# EAGLE design Rx (EAGLE 9.7.0)
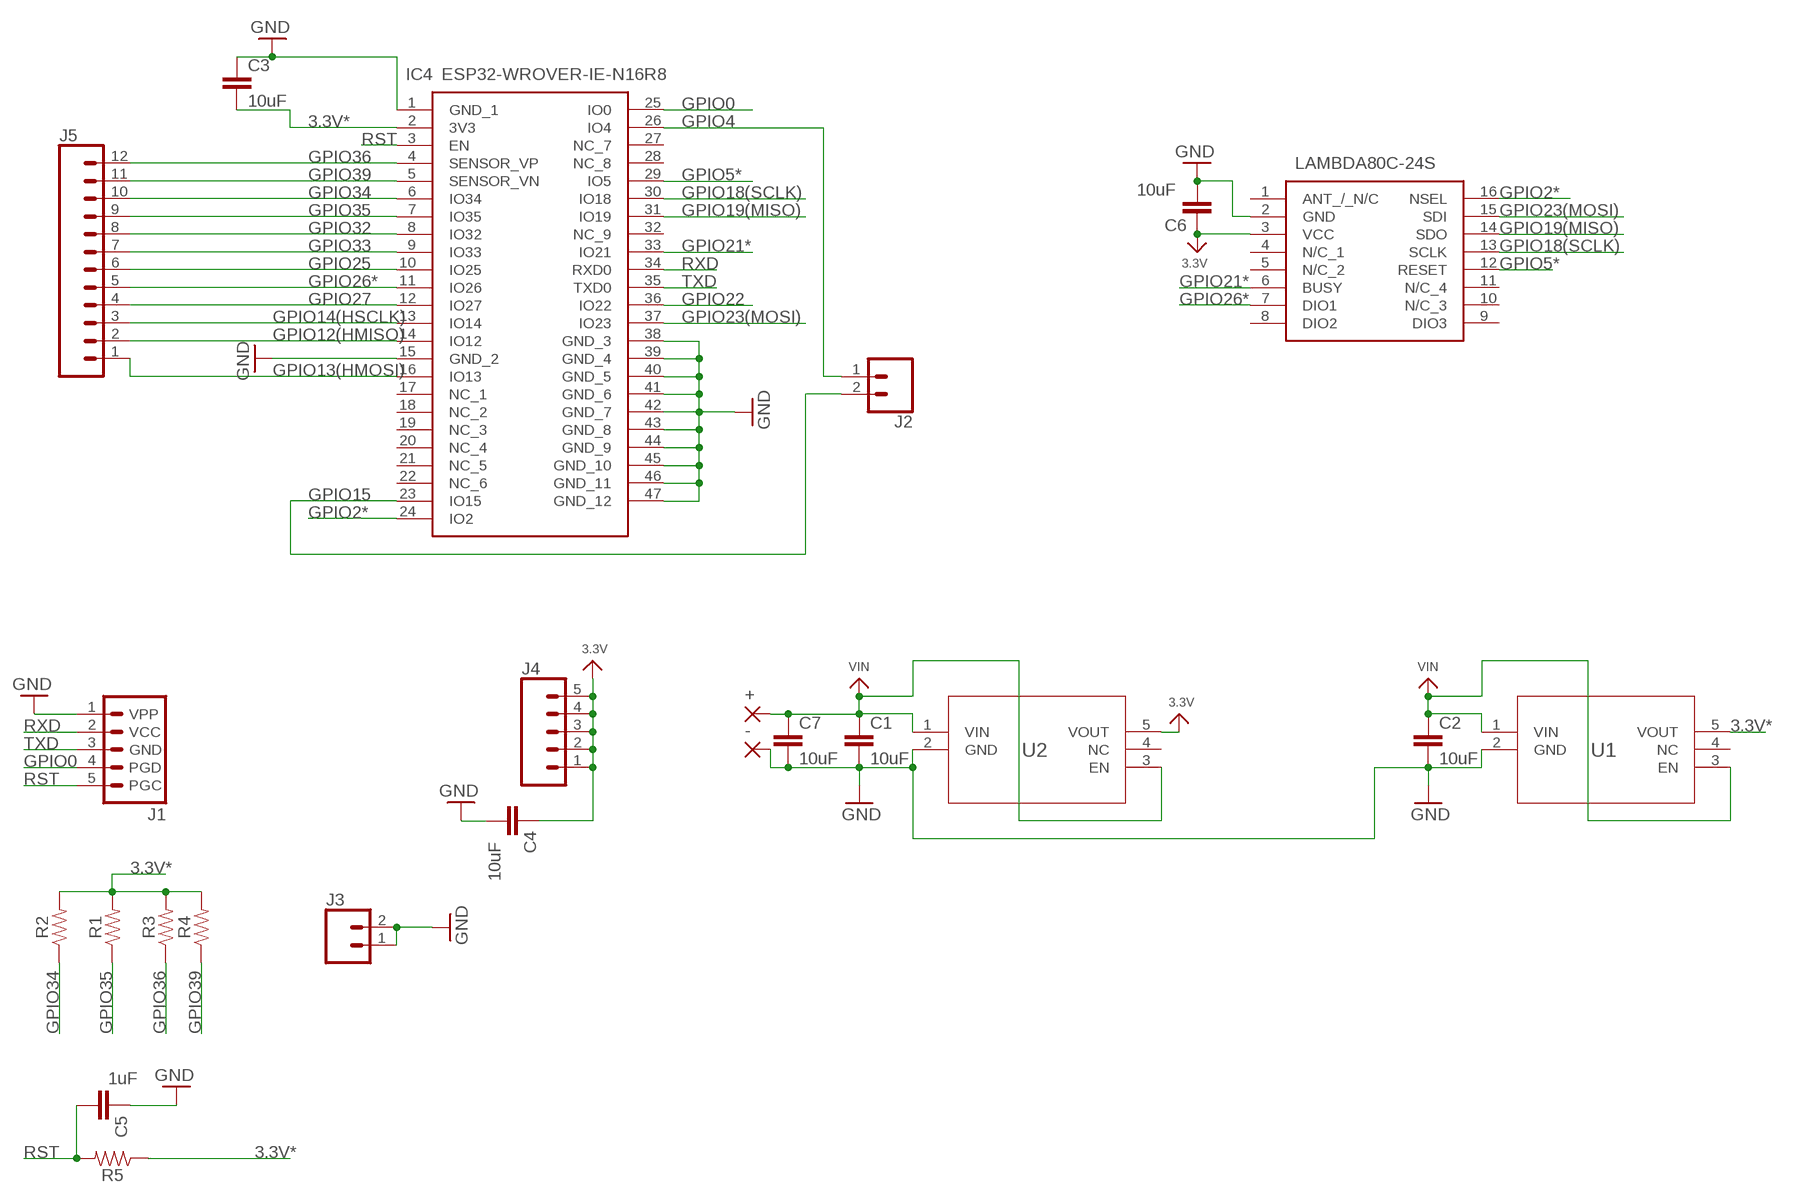
[diagram p0: schematic, sheet 1]

## Parts
+  2,15/1,0  [2,15/1,0]
-  2,15/1,0  [2,15/1,0]
C1  10uF  10UF-0805-10V-10%  [0805]
C2  10uF  10UF-0805-10V-10%  [0805]
C3  10uF  10UF-0805-10V-10%  [0805]
C4  10uF  10UF-0805-10V-10%  [0805]
C5  1uF  10UF-0805-10V-10%  [0805]
C6  10uF  10UF-0805-10V-10%  [0805]
C7  10uF  10UF-0805-10V-10%  [0805]
IC1  LAMBDA80C-24S  [LAMBDA80C24S]
IC4  ESP32-WROVER-IE-N16R8  [ESP32WROVERIEN16R8]
J1  PIC_ICSP_MINI_5_PIN  [PIC_ICSP_MINI_5_PIN]
J2  CONN_021X02_NO_SILK  [1X02_NO_SILK]
J3  CONN_021X02_NO_SILK  [1X02_NO_SILK]
J4  CONN_05NO_SILK  [1X05_NO_SILK]
J5  CONN_12NO_SILK  [1X12_NO_SILK]
R1  0  0OHM-0603-1/10W-5%  [0603]
R2  0  0OHM-0603-1/10W-5%  [0603]
R3  0  0OHM-0603-1/10W-5%  [0603]
R4  0  0OHM-0603-1/10W-5%  [0603]
R5  0  0OHM-0603-1/10W-5%  [0603]
U1  AP2112K-3.3TRG1SOT_RG1_DIO-L  [SOT_RG1_DIO-L]
U2  AP2112K-3.3TRG1SOT_RG1_DIO-L  [SOT_RG1_DIO-L]

## Nets
3.3V: C4.1 C6.1 IC1.3(VCC) J4.1 J4.2 J4.3 J4.4 J4.5 U2.5(VOUT)
3.3V*: C3.2 IC4.2(3V3) R1.2 R2.2 R3.2 R4.2 R5.1 U1.5(VOUT)
GND: -.1(P) C1.2 C2.2 C3.1 C4.2 C5.1 C6.2 C7.2 IC1.2(GND) IC4.1(GND_1) IC4.15(GND_2) IC4.38(GND_3) IC4.39(GND_4) IC4.40(GND_5) IC4.41(GND_6) IC4.42(GND_7) IC4.43(GND_8) IC4.44(GND_9) IC4.45(GND_10) IC4.46(GND_11) IC4.47(GND_12) J1.1(VPP) J3.1 J3.2 U1.2(GND) U2.2(GND)
GPIO0: IC4.25(IO0) J1.4(PGD)
GPIO2*: IC1.16(NSEL) IC4.24(IO2)
GPIO4: IC4.26(IO4) J2.1
GPIO5*: IC1.12(RESET) IC4.29(IO5)
GPIO12(HMISO): IC4.14(IO12) J5.2
GPIO13(HMOSI): IC4.16(IO13) J5.1
GPIO14(HSCLK): IC4.13(IO14) J5.3
GPIO15: IC4.23(IO15) J2.2
GPIO18(SCLK): IC1.13(SCLK) IC4.30(IO18)
GPIO19(MISO): IC1.14(SDO) IC4.31(IO19)
GPIO21*: IC1.6(BUSY) IC4.33(IO21)
GPIO22: IC4.36(IO22)
GPIO23(MOSI): IC1.15(SDI) IC4.37(IO23)
GPIO25: IC4.10(IO25) J5.6
GPIO26*: IC1.7(DIO1) IC4.11(IO26) J5.5
GPIO27: IC4.12(IO27) J5.4
GPIO32: IC4.8(IO32) J5.8
GPIO33: IC4.9(IO33) J5.7
GPIO34: IC4.6(IO34) J5.10 R2.1
GPIO35: IC4.7(IO35) J5.9 R1.1
GPIO36: IC4.4(SENSOR_VP) J5.12 R3.1
GPIO39: IC4.5(SENSOR_VN) J5.11 R4.1
RST: C5.2 IC4.3(EN) J1.5(PGC) R5.2
RXD: IC4.34(RXD0) J1.2(VCC)
TXD: IC4.35(TXD0) J1.3(GND)
VIN: +.1(P) C1.1 C2.1 C7.1 U1.1(VIN) U1.3(EN) U2.1(VIN) U2.3(EN)
Unconnected: IC1.1(ANT_/_N/C) IC1.4(N/C_1) IC1.5(N/C_2) IC1.8(DIO2) IC1.9(DIO3) IC1.10(N/C_3) IC1.11(N/C_4) IC4.17(NC_1) IC4.18(NC_2) IC4.19(NC_3) IC4.20(NC_4) IC4.21(NC_5) IC4.22(NC_6) IC4.27(NC_7) IC4.28(NC_8) IC4.32(NC_9) U1.4(NC) U2.4(NC)

## Library data of the parts
+ - = wirepad:2,15/1,0: THROUGH-HOLE PAD
C1-C4 C6 C7 = SparkFun-Capacitors:10UF: 10.0µF ceramic capacitors A capacitor is a passive two-terminal electrical component used to store electrical energy temporarily in an electric field.; PROD_ID: CAP-11330
C5 = SparkFun-Capacitors:10UF: 10.0µF ceramic capacitors A capacitor is a passive two-terminal electrical component used to store electrical energy temporarily in an electric field.; PROD_ID: CAP-11330; VALUE: 10uF
IC1 = LAMBDA80C-24S:LAMBDA80C-24S: RF Transceiver FSK 3.3V 16-Pin SMD Module Source: Datasheet <https://www.arrow.com/en/products/lambda80c-24s/rf-solutions>; ARROW_PART_NUMBER: LAMBDA80C-24S; ARROW_PRICE-STOCK: https://www.arrow.com/en/products/lambda80c-24s/rf-solutions; DESCRIPTION: RF Transceiver FSK 3.3V 16-Pin SMD Module; HEIGHT: 2mm; MANUFACTURER_NAME: RF SOLUTIONS; MANUFACTURER_PART_NUMBER: LAMBDA80C-24S; MOUSER_PART_NUMBER: 223-LAMBDA80C-24S; MOUSER_PRICE-STOCK: https://www.mouser.co.uk/ProductDetail/RF-Solutions/LAMBDA80C-24S?qs=17u8i%2FzlE89dhjIrlJ9FHg%3D%3D
IC4 = ESP32-Wrover-IE-N16R8:ESP32-WROVER-IE-N16R8: RX TXRX MOD WIFI EXT IPEX SMD Source: Datasheet <https://www.espressif.com/sites/default/files/documentation/esp32-wrover-e_esp32-wrover-ie_datasheet_en.pdf>; DESCRIPTION: RX TXRX MOD WIFI EXT IPEX SMD; HEIGHT: 3.45mm; MANUFACTURER_NAME: Espressif Systems; MANUFACTURER_PART_NUMBER: ESP32-Wrover-IE-N16R8; MOUSER_PART_NUMBER: 356-ESP32WRVIE2864UC; MOUSER_PRICE-STOCK: https://www.mouser.co.uk/ProductDetail/Espressif-Systems/ESP32-WROVER-IE-N16R8?qs=Li%252BoUPsLEnvfUqsrs3zskw%3D%3D
J1 = SparkFun-Connectors:PIC_ICSP_MINI_5_PIN: PIC-ICSP-Mini Miniature 5-pin connection for temporary programming of PICs. Use this device in your design to save space. Miniature ISCP Programming connector for PICs This 5 pin header contains all the lines necessary for programming most PIC microcontrollers. Use this device in your design to save space. Here is the connector we sell at SparkFun: 5-Pin Mini ICSP Connector <https://www.sparkfun.com/products/11264> (PRT-11264) It is used on these SparkFun products: USB Bit Whacker - 18F2553 Development Board <https://www.sparkfun.com/products/762> (DEV-00762) SparkFun Serial Enabled LCD Backpack <https://www.sparkfun.com/products/258> (LCD-00258) Also, if you need a nice PIC programmer, please check these out: MPLAB PICkit 3 <https://www.sparkfun.com/products/9973> (PGM-09973); PROD_ID: CONN-08314; SF_ID: PRT-11264
J2 J3 = SparkFun-Connectors:CONN_02: Multi connection point. Often used as Generic Header-pin footprint for 0.1 inch spaced/style header connections On any of the 0.1 inch spaced packages, you can populate with these: Break Away Headers - Straight <https://www.sparkfun.com/products/116> (PRT-00116) Break Away Male Headers - Right Angle <https://www.sparkfun.com/products/553> (PRT-00553) Female Headers <https://www.sparkfun.com/products/115> (PRT-00115) Break Away Headers - Machine Pin <https://www.sparkfun.com/products/117> (PRT-00117) Break Away Female Headers - Swiss Machine Pin <https://www.sparkfun.com/products/743> (PRT-00743) For SCREWTERMINALS and SPRING TERMINALS visit here: Screw Terimnals on SparkFun.com <https://www.sparkfun.com/search/results?term=Screw+Terminals> (5mm/3.5mm/2.54mm spacing) This device is also useful as a general connection point to wire up your design to another part of your project. Our various solder wires solder well into these plated through hole pads. Hook-Up Wire - Assortment (Stranded, 22 AWG) <https://www.sparkfun.com/products/11375> (PRT-11375) Hook-Up Wire - Assortment (Solid Core, 22 AWG) <https://www.sparkfun.com/products/11367> (PRT-11367) View the entire wire category on our website here <https://www.sparkfun.com/categories/141> Special notes: Molex polarized connector foot print use with: PRT-08233 with associated crimp pins and housings. 2.54_SCREWTERM for use with PRT-10571. 3.5mm Screw Terminal footprints for PRT-08084 5mm Screw Terminal footprints for use with PRT-08432
J4 = SparkFun-Connectors:CONN_05: Multi connection point. Often used as Generic Header-pin footprint for 0.1 inch spaced/style header connections On any of the 0.1 inch spaced packages, you can populate with these: Break Away Headers - Straight <https://www.sparkfun.com/products/116> (PRT-00116) Break Away Male Headers - Right Angle <https://www.sparkfun.com/products/553> (PRT-00553) Female Headers <https://www.sparkfun.com/products/115> (PRT-00115) Break Away Headers - Machine Pin <https://www.sparkfun.com/products/117> (PRT-00117) Break Away Female Headers - Swiss Machine Pin <https://www.sparkfun.com/products/743> (PRT-00743) For SCREWTERMINALS and SPRING TERMINALS visit here: Screw Terimnals on SparkFun.com <https://www.sparkfun.com/search/results?term=Screw+Terminals> (5mm/3.5mm/2.54mm spacing) This device is also useful as a general connection point to wire up your design to another part of your project. Our various solder wires solder well into these plated through hole pads. Hook-Up Wire - Assortment (Stranded, 22 AWG) <https://www.sparkfun.com/products/11375> (PRT-11375) Hook-Up Wire - Assortment (Solid Core, 22 AWG) <https://www.sparkfun.com/products/11367> (PRT-11367) View the entire wire category on our website here <https://www.sparkfun.com/categories/141> Special notes: Molex polarized connector foot print use with SKU : PRT-08231 with associated crimp pins and housings. 1MM SMD Version SKU: PRT-10208
J5 = SparkFun-Connectors:CONN_12: Multi connection point. Often used as Generic Header-pin footprint for 0.1 inch spaced/style header connections On any of the 0.1 inch spaced packages, you can populate with these: Break Away Headers - Straight <https://www.sparkfun.com/products/116> (PRT-00116) Break Away Male Headers - Right Angle <https://www.sparkfun.com/products/553> (PRT-00553) Female Headers <https://www.sparkfun.com/products/115> (PRT-00115) Break Away Headers - Machine Pin <https://www.sparkfun.com/products/117> (PRT-00117) Break Away Female Headers - Swiss Machine Pin <https://www.sparkfun.com/products/743> (PRT-00743) For SCREWTERMINALS and SPRING TERMINALS visit here: Screw Terimnals on SparkFun.com <https://www.sparkfun.com/search/results?term=Screw+Terminals> (5mm/3.5mm/2.54mm spacing) This device is also useful as a general connection point to wire up your design to another part of your project. Our various solder wires solder well into these plated through hole pads. Hook-Up Wire - Assortment (Stranded, 22 AWG) <https://www.sparkfun.com/products/11375> (PRT-11375) Hook-Up Wire - Assortment (Solid Core, 22 AWG) <https://www.sparkfun.com/products/11367> (PRT-11367) View the entire wire category on our website here <https://www.sparkfun.com/categories/141> Special notes: Molex polarized connector foot print use with SKU : PRT-08231 with associated crimp pins and housings. 1MM SMD Version SKU: PRT-10208 NOTES ON THE VARIANTS LOCK and LOCK_LONGPADS... This footprint was designed to help hold the alignment of a through-hole component (i.e. 6-pin header) while soldering it into place. You may notice that each hole has been shifted either up or down by 0.005 of an inch from it's more standard position (which is a perfectly straight line). This slight alteration caused the pins (the squares in the middle) to touch the edges of the holes. Because they are alternating, it causes a "brace" to hold the component in place. 0.005 has proven to be the perfect amount of "off-center" position when using our standard breakaway headers. Although looks a little odd when you look at the bare footprint, once you have a header in there, the alteration is very hard to notice. Also,if you push a header all the way into place, it is covered up entirely on the bottom side.
R1-R5 = SparkFun-Resistors:0OHM: 0Ω resistor A resistor is a passive two-terminal electrical component that implements electrical resistance as a circuit element. Resistors act to reduce current flow, and, at the same time, act to lower voltage levels within circuits. - Wikipedia; PROD_ID: RES-08609
U1 U2 = 2023-03-07_19-05-44_Library:AP2112K-3.3TRG1; COPYRIGHT: Copyright (C) 2023 Ultra Librarian. All rights reserved.; MANUFACTURER_PART_NUMBER: AP2112K-3.3TRG1; MFR_NAME: Diodes Inc

## Board
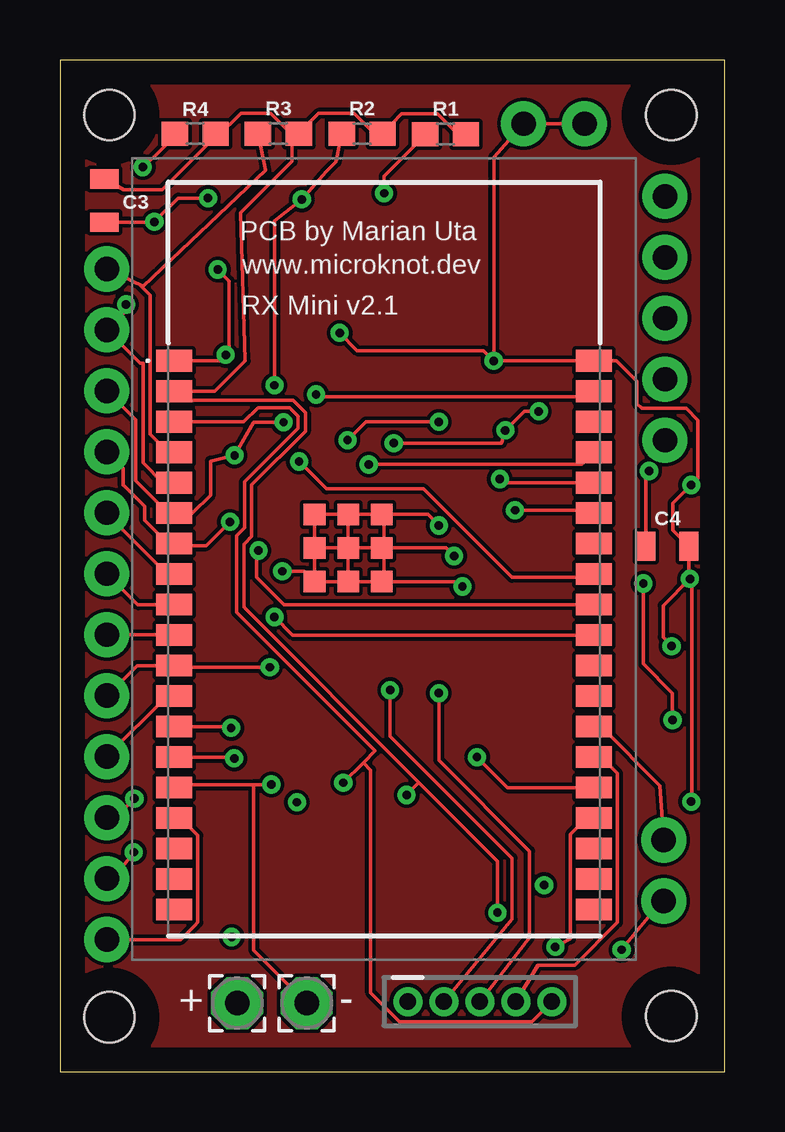
[diagram p1: board, top side]
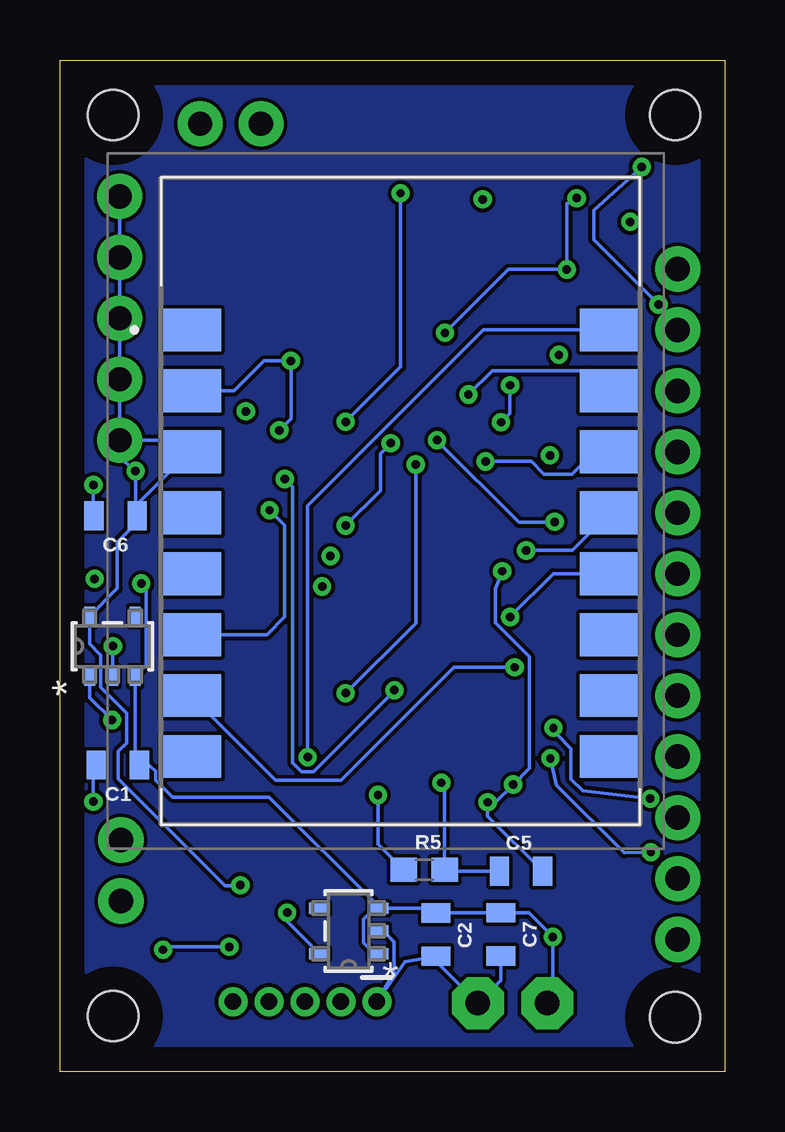
[diagram p2: board, bottom side, seen from below]

Size 27.71 x 42.15 mm. Coordinates in mm from the lower left corner, seen from the top.
Outline: 0,0 27.71,0 27.71,42.15 0,42.15 0,0
Copper layers (1*16): Top 0.035mm / dielectric 1.5mm / Bottom 0.035mm
Design rules "default": minimum track width 6mil, minimum drill 0.35mm, track to track 6mil, track to pad 6mil, pad to pad 6mil, via to via 6mil, smd to smd 6mil, copper to edge 40mil, drill to drill 6mil, minimum pad ring 10mil, minimum via ring 8mil, stop-mask expansion 4mil, vias tented up to drill 0mil, thermal gap 10mil
Holes 2.1 mm at 2.07,2.27 25.49,2.32 25.49,39.86 2.07,39.86

### Footprints (pad centres in the part's own frame; a part is rotated, then mirrored left to right if it is on the bottom)
2,15/1,0 = drill 1.016 pad 2.159 octagon: 1 0,0
0805 = smd 0.8 x 1.2: 1 -0.9,0; 2 0.9,0
LAMBDA80C24S = smd 2.5 x 1.78: 1 -8.725,7.135; 2 -8.725,4.595; 3 -8.725,2.055; 4 -8.725,-0.485; 5 -8.725,-3.025; 6 -8.725,-5.565; 7 -8.725,-8.105; 8 -8.725,-10.645; 9 8.725,-10.645; 10 8.725,-8.105; 11 8.725,-5.565; 12 8.725,-3.025; 13 8.725,-0.485; 14 8.725,2.055; 15 8.725,4.595; 16 8.725,7.135
ESP32WROVERIEN16R8 = smd 1.5 x 0.9: 1 -8.75,8.26; 2 -8.75,6.99; 3 -8.75,5.72; 4 -8.75,4.45; 5 -8.75,3.18; 6 -8.75,1.91; 7 -8.75,0.64; 8 -8.75,-0.63; 9 -8.75,-1.9; 10 -8.75,-3.17; 11 -8.75,-4.44; 12 -8.75,-5.71; 13 -8.75,-6.98; 14 -8.75,-8.25; 15 -8.75,-9.52; 16 -8.75,-10.79; 17 -8.75,-12.06; 18 -8.75,-13.33; 19 -8.75,-14.6; 20 8.75,-14.6; 21 8.75,-13.33; 22 8.75,-12.06; 23 8.75,-10.79; 24 8.75,-9.52; 25 8.75,-8.25; 26 8.75,-6.98; 27 8.75,-5.71; 28 8.75,-4.44; 29 8.75,-3.17; 30 8.75,-1.9; 31 8.75,-0.63; 32 8.75,0.64; 33 8.75,1.91; 34 8.75,3.18; 35 8.75,4.45; 36 8.75,5.72; 37 8.75,6.99; 38 8.75,8.26 | smd 0.9 x 0.9: 39 -1.5,0.46; 40 -1.5,1.86; 41 -2.9,1.86; 42 -2.9,0.46; 43 -2.9,-0.94; 44 -1.5,-0.94; 45 -0.1,-0.94; 46 -0.1,0.46; 47 -0.1,1.86
PIC_ICSP_MINI_5_PIN = drill 0.7: 1 -3,0; 2 -1.5,0; 3 0,0; 4 1.5,0; 5 3,0
1X02_NO_SILK = drill 1.016 pad 1.88: 1 0,0; 2 2.54,0
1X05_NO_SILK = drill 1.016 pad 1.88: 1 0,0; 2 2.54,0; 3 5.08,0; 4 7.62,0; 5 10.16,0
1X12_NO_SILK = drill 1.016 pad 1.88: 1 0,0; 2 2.54,0; 3 5.08,0; 4 7.62,0; 5 10.16,0; 6 12.7,0; 7 15.24,0; 8 17.78,0; 9 20.32,0; 10 22.86,0; 11 25.4,0; 12 27.94,0
0603 = smd 1.1 x 1: 1 -0.85,0; 2 0.85,0
SOT_RG1_DIO-L = smd 0.8 x 0.457: 1 -1.251,0.95; 2 -1.251,0; 3 -1.251,-0.95; 4 1.251,-0.95; 5 1.251,0.95

### Placement (x,y rotation side)
+  7.39,2.86 0 top
-  10.29,2.86 0 top
C1  25.3,12.78 180 bottom
C2  12.04,5.71 270 bottom
C3  1.85,36.3 90 top
C4  25.32,21.89 0 top
C5  8.48,8.36 180 bottom
C6  25.4,23.16 180 bottom
C7  9.33,5.72 270 bottom
IC1  13.51,23.77 0 bottom
IC4  13.51,21.36 0 top
J1  17.5,2.92 0 top
J2  25.17,9.65 270 top
J3  21.87,39.5 180 top
J4  25.22,26.31 90 top
J5  1.96,5.51 90 top
R1  16.08,39.07 0 top
R2  12.6,39.08 0 top
R3  9.11,39.08 0 top
R4  5.64,39.08 0 top
R5  12.52,8.41 0 bottom
U1  15.67,5.87 180 bottom
U2  25.52,17.73 90 bottom

### Tracks (layer width: path | path; a pad name or v marks a point on that pad's centre or on a via)
3.3V  (via drill 0.35)
  Top 0.152: C4.1 24.42,24.89 v24.56,25.03
  Bottom 0.152: J4.1 22.72,26.31 IC1.3 22.29,25.83 24.55,23.57 24.55,23.16 | J4.1 J4.2 J4.3 J4.4 J4.5 | J4.1 25.22,25.58 v24.56,25.04 v24.56,25.03 24.56,23.18 24.55,23.16 | U2.5 25.32,20.13 25.32,22.06 24.55,22.84 24.55,23.16 | v20.19,7.77 20.21,7.76 20.84,7.76 25.28,12.2 25.28,13.34 24.93,13.69 24.93,14.94 26.01,16.02 26.01,17.35 26.48,17.82 U2.5 | 24.55,23.16 C6.1 | U2.5
3.3V*  (via drill 0.35)
  Top 0.152: v18.24,6.63 18.24,8.77 14.95,12.06 | 14.95,12.06 7.67,19.34 7.67,21.97 8,22.3 8,24.45 10.23,26.68 10.23,27.45 9.72,27.97 5.14,27.97 IC4.2 6.45,28.35 7.72,29.62 7.54,35.79 9.68,37.93 9.68,38.84 | C3.2 2.66,36.76 4.27,36.76 6.44,38.93 R4.2 6.54,38.93 7.54,39.93 8.77,39.93 9.69,39.01 9.69,38.88 9.66,38.83 9.68,38.84 | 9.68,38.84 R3.2 10.78,39.93 12.27,39.93 13.12,39.08 R2.2 14.23,39.92 15.75,39.92 16.6,39.07 R1.2 | v14.45,11.53 14.95,12.03 14.95,12.06
  Bottom 0.152: U1.5 17.25,5.24 17.25,5.27 18.24,6.26 v18.24,6.63 | v14.45,11.53 14.45,9.47 13.39,8.41 R5.1
GND  (via drill 0.35)
  Top 0.152: IC4.15 4.88,11.96 v8.81,11.96 8.08,11.96 8.08,5.07 -.1 | 13.51,23.22 IC4.47 IC4.41 IC4.42 10.72,21.82 | 13.51,20.42 IC4.45 12.06,20.42 12.01,20.47 | IC4.43 10.18,20.85 v9.27,20.85 | v15.8,22.76 15.34,23.22 13.51,23.22 | v16.43,21.49 16.1,21.82 IC4.46 | v18.09,29.62 IC4.38 23.2,29.62 24.05,28.77 24.05,27.84 24.26,27.63 26.11,27.63 26.59,27.15 26.59,24.73 v26.32,24.45 25.56,23.69 25.56,22.56 C4.2 26.22,20.58 v26.27,20.54 | 10.72,21.82 IC4.39 | IC4.46 IC4.39 | IC4.39 12.01,20.47 | 12.01,20.47 IC4.44 IC4.43 | IC4.43 10.61,21.72 10.72,21.82 | IC4.39 IC4.40 | IC4.46 13.51,21.92 13.51,23.22 | IC4.46 13.51,21.72 13.51,20.42 | IC4.1 6.66,29.62 v6.91,29.87 7.06,30.02 7.06,32.94 v6.58,33.43 | v18.09,29.62 v18.08,29.62 17.65,30.05 12.39,30.05 v11.66,30.78 | v16.78,20.22 16.58,20.42 13.51,20.42 | v13.92,26.19 18.41,26.19 v18.57,26.72 19.36,27.52 v19.96,27.52 | v18.09,29.62 18.09,38.11 J3.2 J3.1 | v6.17,36.4 4.93,36.4 v3.94,35.41 3.93,35.4 C3.1 | v26.32,11.25 26.34,11.28 26.34,20.46 v26.27,20.54 | v26.27,20.54 25.15,19.42 25.15,18.11 25.5,17.75 v25.5,17.73
  Bottom 0.152: v9.27,20.85 9.55,20.12 9.55,18.7 8.14,17.29 8.14,12.63 v8.81,11.96 9.55,11.23 v9.88,11.23 9.88,10.65 C5.1 | U1.2 14.25,5.87 13.79,5.41 13.79,4.11 J1.1 13.32,4.59 C2.2 11.92,4.59 11.92,4.49 -.1 9.33,3.82 C7.2 | v11.66,30.78 9.02,33.43 v6.58,33.43 6.58,36.17 v6.17,36.4 | v13.92,26.19 14.35,25.76 14.35,24.21 v15.8,22.76 | v18.57,26.72 18.08,27.2 v18.08,29.62 19.2,29.62 20.45,28.37 IC1.2 | C1.2 26.32,12.66 v26.32,11.25 | C6.2 26.32,23.19 26.32,23.2 v26.32,24.45 | v25.5,17.73 25.52,17.71 U2.2
GPIO0
  Top 0.152: J1.4 19.93,4.44 21.46,4.44 23.24,6.22 23.24,12.39 23.24,12.43 22.56,13.11 IC4.25
GPIO2*  (via drill 0.35)
  Top 0.152: v17.39,13.11 18.65,11.84 IC4.24
  Bottom 0.152: IC1.16 10.06,30.91 17.39,23.58 v17.39,13.11
GPIO4
  Top 0.152: IC4.26 22.56,14.38 25.02,11.92 J2.1
GPIO5*  (via drill 0.35)
  Top 0.152: IC4.29 9.7,18.19 v8.94,18.95
  Bottom 0.152: IC1.12 7.14,20.75 v8.94,18.95
GPIO12(HMISO)  (via drill 0.35)
  Top 0.152: IC4.14 7.21,13.11 v7.26,13.06 | v3.08,9.14 2.23,8.05 J5.2
  Bottom 0.152: v3.08,9.14 4.19,9.12 7.01,11.94 v7.26,13.06
GPIO13(HMOSI)
  Top 0.152: IC4.16 5.02,10.57 5.74,9.85 5.74,6.22 5.61,6.08 5.03,5.51 J5.1
GPIO14(HSCLK)  (via drill 0.35)
  Top 0.152: IC4.13 6.9,14.38 v7.14,14.33 | v3.1,11.38 2.31,10.59 J5.3
  Bottom 0.152: v3.1,11.38 5.92,11.71 6.4,12.19 6.4,13.46 6.96,14.02 v7.14,14.33
GPIO15  (via drill 0.35)
  Top 0.152: IC4.23 21.96,10.57 21.28,9.89 21.28,5.53 v20.65,5.2 | J2.2 25.02,7.01 v23.42,5.08
  Bottom 0.152: v20.65,5.2 23.21,5.2 v23.42,5.08
GPIO18(SCLK)  (via drill 0.35)
  Top 0.152: IC4.30 9.35,19.46 8.21,20.6 8.21,21.65 v8.27,21.72
  Bottom 0.152: IC1.13 6.34,21.73 8.26,21.73 v8.27,21.72
GPIO19(MISO)  (via drill 0.35)
  Top 0.152: IC4.31 22.13,20.6 18.85,20.6 15.16,24.28 11.11,24.28 v9.97,25.43
  Bottom 0.152: IC1.14 5.43,25.83 6.37,24.89 7.53,24.89 8.06,25.43 v9.97,25.43
GPIO21*  (via drill 0.35)
  Top 0.152: IC4.33 22.14,23.39 v18.97,23.39
  Bottom 0.152: IC1.6 19.08,18.21 18.34,18.95 18.34,22.76 v18.97,23.39
GPIO23(MOSI)  (via drill 0.35)
  Top 0.152: v10.68,28.22 10.77,28.12 22.03,28.12 IC4.37
  Bottom 0.152: v10.68,28.22 9.69,29.21 5.63,29.21 IC1.15
GPIO25
  Top 0.152: 4.72,18.24 IC4.10 4.72,18.24 | J5.6 4.69,18.21 4.72,18.24
GPIO26*  (via drill 0.35)
  Top 0.152: v8.75,16.85 4.83,16.85 IC4.11 3.21,16.92 J5.5
  Bottom 0.152: IC1.7 18.72,12.15 15.99,12.15 11.29,16.85 v8.75,16.85
GPIO27
  Top 0.152: J5.4 1.96,13.14 4.46,15.65 IC4.12
GPIO32
  Top 0.152: 4.46,20.73 IC4.8 4.46,20.73 | 4.46,20.73 1.96,23.24 J5.8
GPIO33
  Top 0.152: IC4.9 3.3,19.46 3.24,19.46 J5.7
GPIO34  (via drill 0.35)
  Top 0.152: v9.32,27.06 8.07,27.06 v7.28,25.68 6.27,25.44 6.27,24.03 5.52,23.27 IC4.6 4.64,23.39 4.39,23.39 3.16,24.62 3.16,27.17 J5.10 | v8.94,28.6 8.94,35.46 v10.08,36.35 11.1,37.49 11.52,37.91 R2.1
  Bottom 0.152: v8.94,28.6 8.95,28.6 8.95,27.43 v9.32,27.06
GPIO35  (via drill 0.35)
  Top 0.152: IC4.7 4.68,21.92 | 4.68,21.92 4.64,21.87 3.54,22.97 3.54,23.56 2.66,24.43 2.64,24.43 2.64,25.14 J5.9 | 4.68,21.92 6.1,21.92 v7.09,22.91 | v11.99,26.31 12.75,27.08 v15.8,27.08 | v13.51,36.6 13.51,37.31 15.09,38.89 15.1,38.94 R1.1
  Bottom 0.152: v11.99,26.31 11.99,26.29 8.58,22.89 7.11,22.89 v7.09,22.91 | v13.51,36.6 13.51,29.36 v15.8,27.08
GPIO36
  Top 0.152: IC4.4 4.67,25.91 4.41,25.91 3.77,26.55 3.77,32.35 3.35,32.76 3.46,32.74 | R3.1 8.58,37.57 3.46,32.74 | 3.46,32.74 J5.12
GPIO39  (via drill 0.35)
  Top 0.152: IC4.5 4.28,24.54 3.46,25.36 3.46,29.53 3.34,29.53 J5.11 2.75,31.7 v2.75,31.97 | R4.1 4.74,38.93 3.99,38.18 v3.45,37.69
  Bottom 0.152: v3.45,37.69 5.46,35.89 5.46,34.67 v2.75,31.97
N$1
  pour Top: 0.1,0.1 27.61,0.1 27.61,42.06 0.1,42.06
  pour Bottom: 0.1,0.1 27.61,0.1 27.61,42.06 0.1,42.06
RST  (via drill 0.35)
  Top 0.152: IC4.3 7.67,27.08 8.25,27.67 9.57,27.67 9.93,27.31 9.93,26.81 7.69,24.57 7.69,22.66 7.36,22.33 7.36,19.15 13.14,13.37 12.65,12.88 | J1.5 19.67,2.09 14.16,2.09 12.96,3.29 12.96,12.56 12.65,12.88 | 12.65,12.88 v11.81,12.04 | v11.81,12.04
  Bottom 0.152: v11.81,12.04 11.67,11.9 R5.2 11.62,8.36 C5.2
RXD  (via drill 0.35)
  Top 0.152: v13.77,15.9 13.77,13.98 18.85,8.9 18.85,6.35 J1.2 | IC4.34 18.49,24.54 v18.34,24.7
  Bottom 0.152: v13.77,15.9 13.77,15.87 17.13,12.5 17.64,12.5 18.01,12.87 18.01,24.37 v18.34,24.7
TXD  (via drill 0.35)
  Top 0.152: v15.8,15.77 15.8,12.98 19.58,9.2 19.58,5.59 J1.3 | IC4.35 21.75,25.3 v12.88,25.3
  Bottom 0.152: v12.88,25.3 12.88,18.69 v15.8,15.77
VIN  (via drill 0.35)
  Top 0.152: v24.32,20.34 24.32,16.99 25.54,15.77 v25.54,14.66
  Bottom 0.152: U2.3 24.58,12.95 C1.1 23.99,12.78 23.72,12.51 23.72,12.15 23.01,11.44 18.98,11.44 14.48,6.93 14.59,6.82 | 14.59,6.82 U1.3 12.24,6.82 C2.1 C7.1 8.17,6.62 v7.16,5.61 7.16,3.09 +.1 | U1.1 14.59,4.92 15.05,5.37 15.05,6.36 14.59,6.82 | U2.3 | v25.54,14.66 26.47,15.58 U2.1 | U2.3 24.11,16.95 24.11,20.13 v24.32,20.34

### Text on the board
tNames: PCB by Marian Uta | www.microknot.dev | RX Mini v2.1